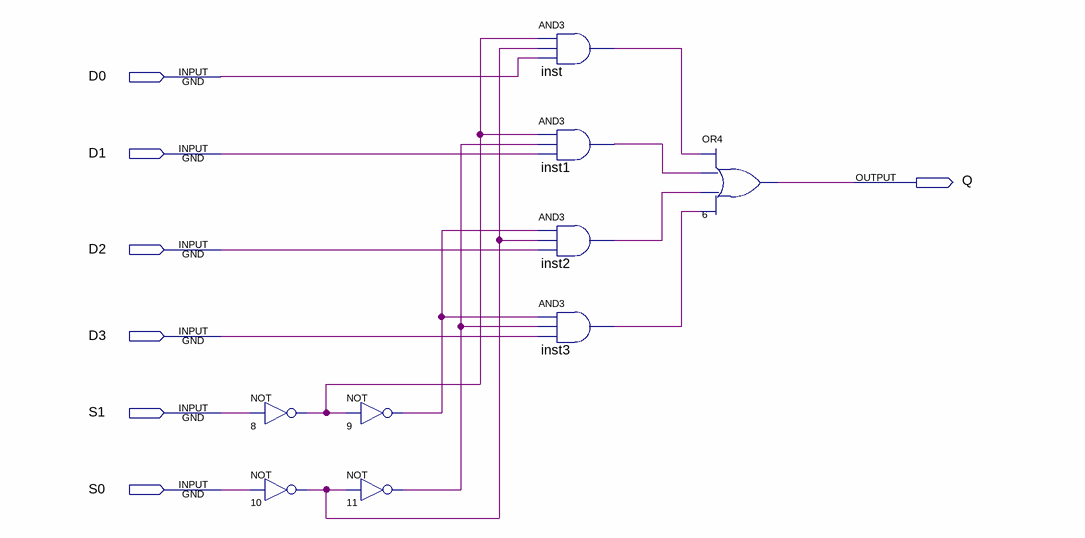
[diagram p0: schematic sheet]
// Quartus schematic MUX41.bdf as structural Verilog: 9 symbols, 7 pins
module MUX41 (
  input  D0,
  input  D1,
  input  D2,
  input  D3,
  input  S1,
  input  S0,
  output Q
);

  wire inst1_out, inst2_out, inst3_out, inst_out, n8_out, n9_out, n10_out, n11_out;

  not u_8 (n8_out, S1);
  not u_10 (n10_out, S0);
  not u_9 (n9_out, n8_out);
  not u_11 (n11_out, n10_out);
  and inst (inst_out, n8_out, n10_out, D0);
  and inst1 (inst1_out, n8_out, n11_out, D1);
  and inst2 (inst2_out, n9_out, n10_out, D2);
  and inst3 (inst3_out, n9_out, n11_out, D3);
  or u_6 (Q, inst_out, inst1_out, inst2_out, inst3_out);
endmodule
